# Altium schematic sheet H-Bridge-Driver_V1.0.SchDoc: H-Bridge-Driver
size A4; PageSetup: Record=PageOptions|CenterHorizontal=True|CenterVertical=True|PrintScale=0.97|XCorrection=1.00|YCorrection=1.00|PrintKind=0|BorderSize=5000000|LeftOffset=0|BottomOffset=0|Orientation=2|PaperLength=1000|PaperWidth=1000|Scale=100|PaperSource=7|PrintQuality=-3|MediaType=1|DitherType=10|PrintScaleMode=1|PaperKind=A4|PaperIndex=9; Organization: Ostschweizer Fachhochschule; Address2: Florian Baumgartner; Address3: florian.baumgartner@ost.ch; Revision: V1.0; SheetNumber: 1; SheetTotal: 1; Author: Florian Baumgartner; Subtitle: Prototype
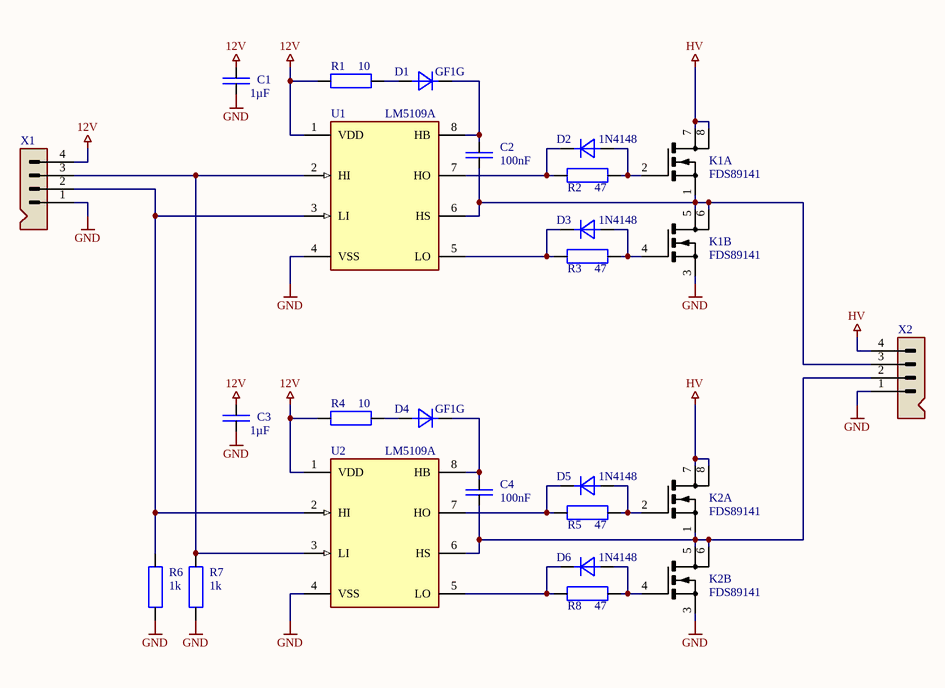
[diagram p0: H-Bridge-Driver_V1.0.SchDoc]

## Parts
C1  1µF  [SMD Keramikkondensator 0603]
C2  100nF  [SMD Keramikkondensator 0603]
C3  1µF  [SMD Keramikkondensator 0603]
C4  100nF  [SMD Keramikkondensator 0603]
D1  GF1G  [SMD Diode DO-214-AC (SMA)]
D2  1N4148  [SMD Diode DO-213-AA]
D3  1N4148  [SMD Diode DO-213-AA]
D4  GF1G  [SMD Diode DO-214-AC (SMA)]
D5  1N4148  [SMD Diode DO-213-AA]
D6  1N4148  [SMD Diode DO-213-AA]
K1  FDS89141  [SMD IC SOIC-8]  (parts A,B of 2)
K2  FDS89141  [SMD IC SOIC-8]  (parts A,B of 2)
R1  10  [SMD Widerstand 0603]
R2  47  [SMD Widerstand 0603]
R3  47  [SMD Widerstand 0603]
R4  10  [SMD Widerstand 0603]
R5  47  [SMD Widerstand 0603]
R6  1k  [SMD Widerstand 0603]
R7  1k  [SMD Widerstand 0603]
R8  47  [SMD Widerstand 0603]
U1  LM5109A  [SMD IC SOIC-8]
U2  LM5109A  [SMD IC SOIC-8]
X1  Stiftleiste (4-Fach)  [THT Stiftleiste 1x4]  (value not drawn)
X2  Stiftleiste (4-Fach)  [THT Stiftleiste 1x4]  (value not drawn)

## Nets
12V: C1.2 C3.2 R1.2 R4.2 U1.1(VDD) U2.1(VDD) X1.4
GND: C1.1 C3.1 K1.3(S2) K2.3(S2) R6.1 R7.1 U1.4(VSS) U2.4(VSS) X1.1 X2.1
HV: K1.7(D1) K1.8(D1) K2.7(D1) K2.8(D1) X2.4
NetC2_1: C2.1 K1.1(S1) K1.5(D2) K1.6(D2) U1.6(HS) X2.3
NetC2_2: C2.2 D1.K U1.8(HB)
NetC4_1: C4.1 K2.1(S1) K2.5(D2) K2.6(D2) U2.6(HS) X2.2
NetC4_2: C4.2 D4.K U2.8(HB)
NetD1_A: D1.A R1.1
NetD2_A: D2.A K1.2(G1) R2.1
NetD2_K: D2.K R2.2 U1.7(HO)
NetD3_A: D3.A K1.4(G2) R3.1
NetD3_K: D3.K R3.2 U1.5(LO)
NetD4_A: D4.A R4.1
NetD5_A: D5.A K2.2(G1) R5.1
NetD5_K: D5.K R5.2 U2.7(HO)
NetD6_A: D6.A K2.4(G2) R8.1
NetD6_K: D6.K R8.2 U2.5(LO)
NetR6_2: R6.2 U1.3(LI) U2.2(HI) X1.2
NetR7_2: R7.2 U1.2(HI) U2.3(LI) X1.3

## Notes on the sheet
- Title
- Author:
- Subtitle
- Date:
- Rev:
- File:
- Sheet
- of

## Library data of the parts
C1 C3 = C-CAPACITOR: CAP-MK; Beschreibung: Keramikvielschichtkondensator; Bauteilwert: 1µF 50V; Stückpreis: 0.01; Digikey: 1276-1860-1-ND; Farnell: 3013383; Mouser: 187-CL10A105KB8NNNC; JLC-Parts: C15849
C2 C4 = C-CAPACITOR: CAP-MK; Beschreibung: Keramikvielschichtkondensator; Bauteilwert: 100nF 50V; Stückpreis: 0.01; Digikey: 445-5666-1-ND; Farnell: 2522432; Mouser: 77-VJ0603V104ZXAPBC; JLC-Parts: C14663
D1 D4 = R-DIODE: DIODE (alt V); Beschreibung: General Purpose Rectifier Diode; Stückpreis: 0.43; Bauteilwert: GF1G; Digikey: GF1GFSCT-ND; Farnell: 1467478; Mouser: 512-GF1G
D2 D3 D5 D6 = R-DIODE: DIODE (alt V); Beschreibung: Kleinsignal-Diode; Bauteilwert: 1N4148WS-7-F; Stückpreis: 0.14; Digikey: 1N4148WSFSCT-ND; Farnell: 2453269; Mouser: 621-1N4148WSF-7
K1 K2 = K-FDS89141: Dual N-Channel MOSFET; Stückpreis: 1.90; Bauteilwert: FDS89141; Beschreibung: Dual N-Channel MOSFET; Digikey: FDS89141CT-ND; Farnell: 2083349; Mouser: 512-FDS89141; ComponentLink1Description: Datasheet; ComponentLink1URL: https://datasheet.lcsc.com/szlcsc/1810201610_Sinopower-Semicon-APM4953KC-TRG_C20897.pdf; JLC-Parts: C606116
R1 R4 = R-RESISTOR: RES (E=Heizwiderstand B=Messwandler); Beschreibung: Dickschicht Chipwiderstand; Bauteilwert: 10 (75V, 100mW, 1%); Stückpreis: 0.01; Digikey: P10.0HCT-ND; Farnell: 2302958; Mouser: 667-ERJ-3EKF10R0V; JLC-Parts: C22859
R2 R3 R5 R8 = R-RESISTOR: RES (E=Heizwiderstand B=Messwandler); Beschreibung: Dickschicht Chipwiderstand; Bauteilwert: 47 (75V, 100mW, 1%); Stückpreis: 0.01; Digikey: P47.0HCT-ND; Farnell: 2303030; Mouser: 667-ERJ-3EKF47R0V; JLC-Parts: C23182
R6 R7 = R-RESISTOR: RES (E=Heizwiderstand B=Messwandler); Beschreibung: Dickschicht Chipwiderstand; Bauteilwert: 1k (75V, 100mW, 1%); Stückpreis: 0.01; Digikey: P1.00KHCT-ND; Farnell: 2303145; Mouser: 667-ERJ-3EKF1001V; JLC-Parts: C21190
U1 U2 = U-LM5109A: High Voltage 1A Peak Half Bridge Gate Driver; Component Description: High Voltage Gate Driver; ComponentLink1Description: Datasheet; ComponentLink1URL: https://www.ti.com/lit/ds/symlink/lm5109a.pdf?HQS=dis-mous-null-mousermode-dsf-pf-null-wwe&ts=1646723200072&ref_url=https%253A%252F%252Fwww.mouser.ch%252F; Digikey: LM5109AMA/NOPB-ND; Component Value: LM5109A; Farnell: 3005775; JLC-Parts: C129332; Mouser: 926-LM5109AMA/NOPB
X1 X2 = X-Stiftleiste (4-Fach): Bauteilwert: 4-Pol; Stückpreis: 0.10; Beschreibung: Stiftleiste